# Altium schematic sheet Main.SchDoc: Main Schematic
size A3; ApprovedBy: LD Stanton; CheckedBy: None; Author: LD Stanton; DrawnBy: LD Stanton; Engineer: LD Stanton; Organization: University of Cape Town; Address1: Department of Electrical Engineering; Address2: Menzies Building, Upper Campus; Address3: Cape Town, South Africa; Address4: 7701; DocumentNumber: 2; Revision: v1.0; SheetNumber: 2; SheetTotal: 20; Project_Name: Photovoltaic Controller
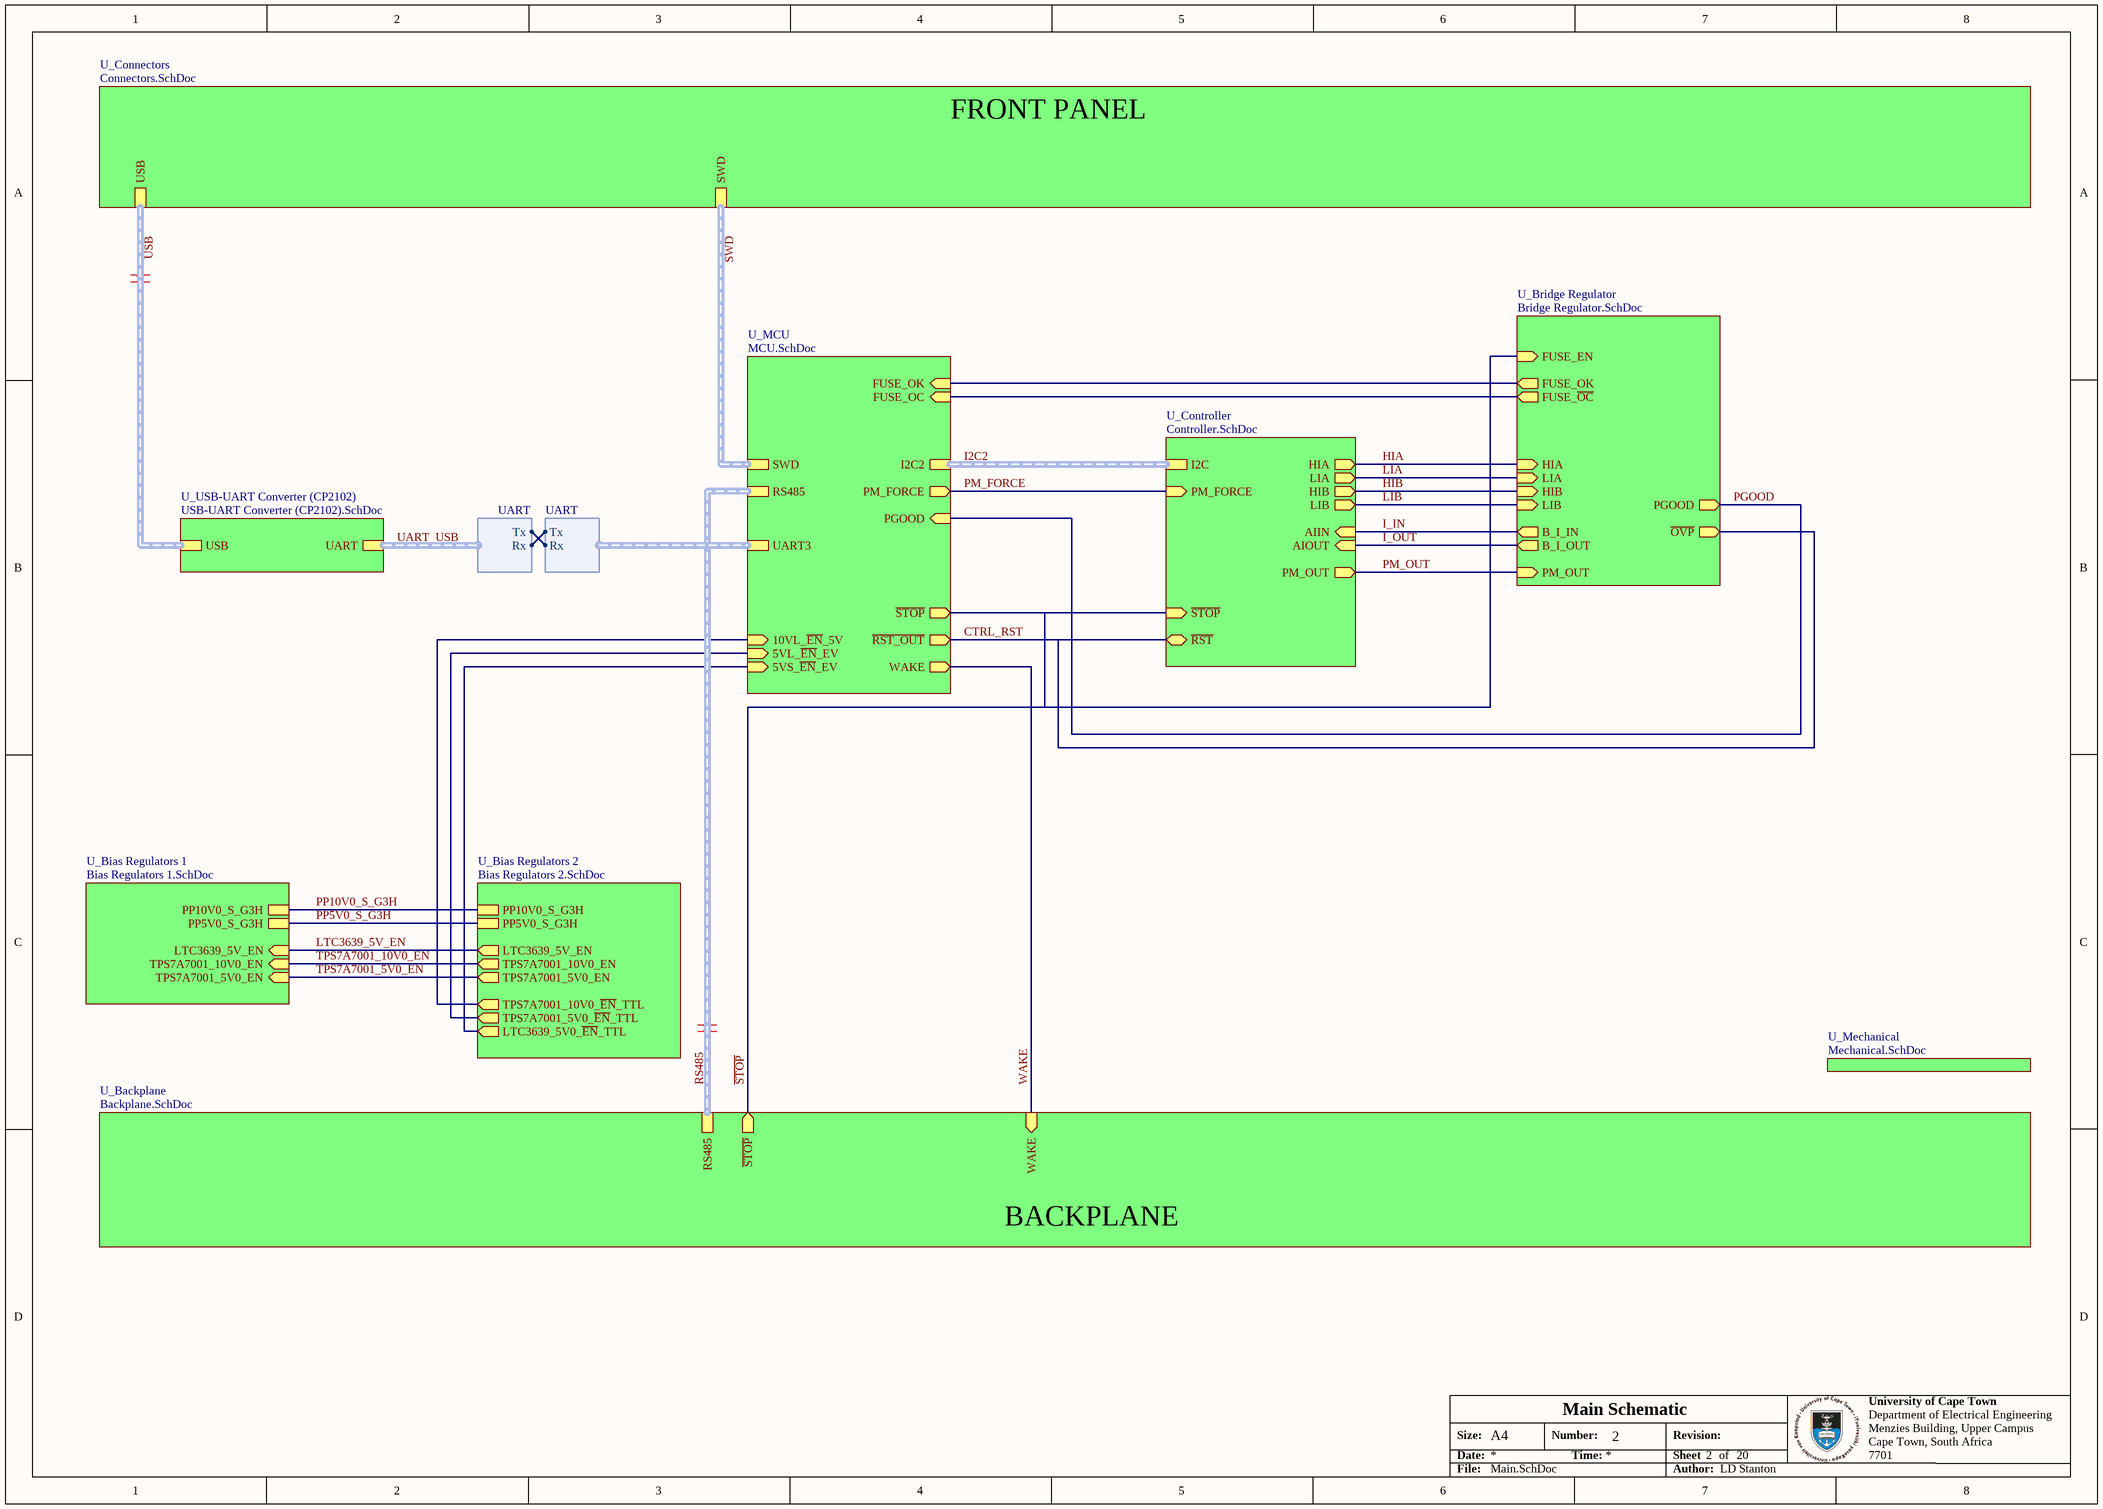
[diagram p0: Main.SchDoc]

## Sub-sheets
U_Backplane = Backplane.SchDoc: RS485 (harness RS485), ~{STOP} (out), WAKE (in)
U_Bias Regulators 1 = Bias Regulators 1.SchDoc: PP10V0_S_G3H, TPS7A7001_5V0_EN (in), LTC3639_5V_EN (in), TPS7A7001_10V0_EN (in), PP5V0_S_G3H
U_Bias Regulators 2 = Bias Regulators 2.SchDoc: PP5V0_S_G3H, PP10V0_S_G3H, LTC3639_5V_EN (out), TPS7A7001_10V0_EN (out), TPS7A7001_5V0_EN (out), TPS7A7001_10V0_~{EN}_TTL (out), LTC3639_5V0_~{EN}_TTL (out), TPS7A7001_5V0_~{EN}_TTL (out)
U_Bridge Regulator = Bridge Regulator.SchDoc: LIA (in), HIA (in), HIB (in), LIB (in), B_I_IN (out), B_I_OUT (out), PGOOD (out), ~{OVP} (out), PM_OUT (in), FUSE_EN (in), FUSE_OK (out), FUSE_~{OC} (out)
U_Connectors = Connectors.SchDoc: USB (harness USB), SWD (harness SWD)
U_Controller = Controller.SchDoc: LIB (out), HIA (out), I2C (harness I2C), PM_OUT (out), AIIN (in), AIOUT (in), ~{RST} (bidir), HIB (out), LIA (out), PM_FORCE (in), ~{STOP} (in)
U_MCU = MCU.SchDoc: SWD (harness SWD), UART3 (harness UART), ~{RST_OUT} (out), PM_FORCE (out), WAKE (out), RS485 (harness RS485), I2C2 (harness I2C), FUSE_OK (in), ~{STOP} (out), FUSE_OC (in), PGOOD (in), 5VS_~{EN}_EV (in), 10VL_~{EN}_5V (in), 5VL_~{EN}_EV (in)
U_Mechanical = Mechanical.SchDoc: no entries
U_USB-UART Converter (CP2102) = USB-UART Converter (CP2102).SchDoc: USB (harness USB), UART (harness UART)

## Harnesses
UART: Rx, Tx

## Nets
~{STOP}: sheet U_MCU/~{STOP}, sheet U_Controller/~{STOP}, sheet U_Bridge Regulator/FUSE_EN, sheet U_Backplane/~{STOP}
CTRL_RST: sheet U_MCU/~{RST_OUT}, sheet U_Controller/~{RST}, sheet U_Bridge Regulator/~{OVP}
HIA: sheet U_Controller/HIA, sheet U_Bridge Regulator/HIA
HIB: sheet U_Controller/HIB, sheet U_Bridge Regulator/HIB
I_IN: sheet U_Controller/AIIN, sheet U_Bridge Regulator/B_I_IN
I_OUT: sheet U_Controller/AIOUT, sheet U_Bridge Regulator/B_I_OUT
LIA: sheet U_Controller/LIA, sheet U_Bridge Regulator/LIA
LIB: sheet U_Controller/LIB, sheet U_Bridge Regulator/LIB
LTC3639_5V_EN: sheet U_Bias Regulators 1/LTC3639_5V_EN, sheet U_Bias Regulators 2/LTC3639_5V_EN
PGOOD: sheet U_MCU/PGOOD, sheet U_Bridge Regulator/PGOOD
PM_FORCE: sheet U_MCU/PM_FORCE, sheet U_Controller/PM_FORCE
PM_OUT: sheet U_Controller/PM_OUT, sheet U_Bridge Regulator/PM_OUT
PP5V0_S_G3H: sheet U_Bias Regulators 1/PP5V0_S_G3H, sheet U_Bias Regulators 2/PP5V0_S_G3H
PP10V0_S_G3H: sheet U_Bias Regulators 1/PP10V0_S_G3H, sheet U_Bias Regulators 2/PP10V0_S_G3H
TPS7A7001_5V0_EN: sheet U_Bias Regulators 1/TPS7A7001_5V0_EN, sheet U_Bias Regulators 2/TPS7A7001_5V0_EN
TPS7A7001_10V0_EN: sheet U_Bias Regulators 1/TPS7A7001_10V0_EN, sheet U_Bias Regulators 2/TPS7A7001_10V0_EN
UART_USB.Rx: sheet U_USB-UART Converter (CP2102)/UART.Rx, sheet U_MCU/UART3.Tx
UART_USB.Tx: sheet U_USB-UART Converter (CP2102)/UART.Tx, sheet U_MCU/UART3.Rx
WAKE: sheet U_MCU/WAKE, sheet U_Backplane/WAKE
(unnamed): sheet U_MCU/FUSE_OK, sheet U_Bridge Regulator/FUSE_OK
(unnamed): sheet U_MCU/FUSE_OC, sheet U_Bridge Regulator/FUSE_~{OC}
(unnamed): sheet U_MCU/5VS_~{EN}_EV, sheet U_Bias Regulators 2/LTC3639_5V0_~{EN}_TTL
(unnamed): sheet U_MCU/10VL_~{EN}_5V, sheet U_Bias Regulators 2/TPS7A7001_10V0_~{EN}_TTL
(unnamed): sheet U_MCU/5VL_~{EN}_EV, sheet U_Bias Regulators 2/TPS7A7001_5V0_~{EN}_TTL

## Buses and harness runs
harness I2C2 = sheet U_Controller/I2C = sheet U_MCU/I2C2
harness RS485 = sheet U_Backplane/RS485 = sheet U_MCU/RS485
harness SWD = sheet U_Connectors/SWD = sheet U_MCU/SWD
harness UART_USB = sheet U_USB-UART Converter (CP2102)/UART
harness USB = sheet U_Connectors/USB = sheet U_USB-UART Converter (CP2102)/USB

## Layout directives
differential pair: (no net found under the mark)

## Notes on the sheet
- FRONT PANEL
- BACKPLANE
- Size:
- Date:
- A4
- Number:
- Time:
- Revision:
- Sheet
- of
- File:
- Author: